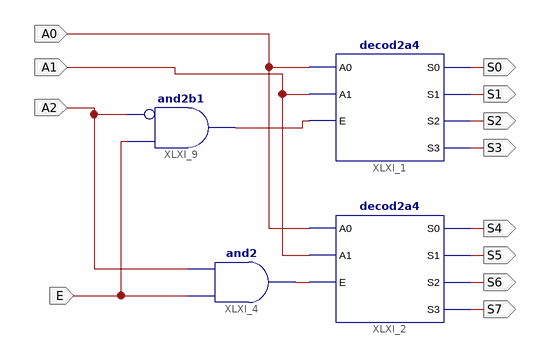
[diagram p0: schematic sheet 1]
// Xilinx ISE schematic decod3a8.sch (spartan3e) as structural Verilog: 4 symbols, 12 ports
module decod3a8 (
  input  E,
  input  A2,
  input  A1,
  input  A0,
  output S0,
  output S1,
  output S2,
  output S3,
  output S4,
  output S5,
  output S6,
  output S7
);

  wire XLXN_12, XLXN_13;

  decod2a4 XLXI_1 (.A0(A0), .A1(A1), .E(XLXN_12), .S0(S0), .S1(S1), .S2(S2), .S3(S3));
  decod2a4 XLXI_2 (.A0(A0), .A1(A1), .E(XLXN_13), .S0(S4), .S1(S5), .S2(S6), .S3(S7));
  and XLXI_4 (XLXN_13, E, A2);
  and XLXI_9 (XLXN_12, ~A2, E);  // and2b1
endmodule
